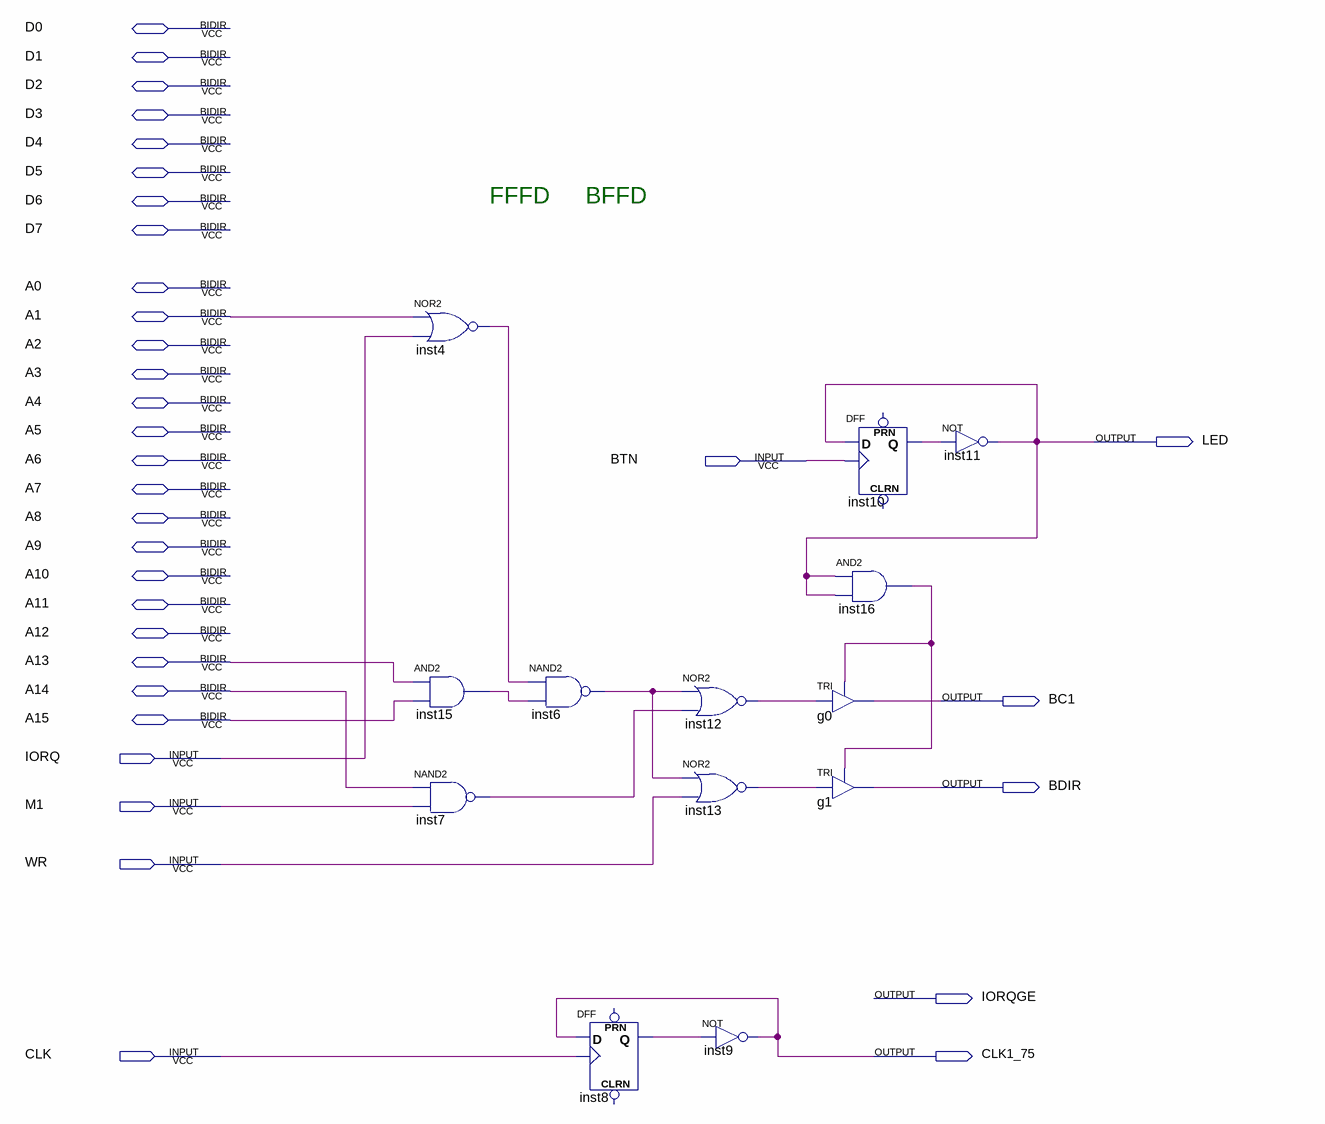
[diagram p0: schematic sheet]
// Quartus schematic ay_first_test.bdf as structural Verilog: 13 symbols, 34 pins
module ay_first_test (
  input  BTN,
  input  IORQ,
  input  M1,
  input  WR,
  input  CLK,
  inout  D0,
  inout  D1,
  inout  D2,
  inout  D3,
  inout  D4,
  inout  D5,
  inout  D6,
  inout  D7,
  inout  A0,
  inout  A1,
  inout  A2,
  inout  A3,
  inout  A4,
  inout  A5,
  inout  A6,
  inout  A7,
  inout  A8,
  inout  A9,
  inout  A10,
  inout  A11,
  inout  A12,
  inout  A13,
  inout  A14,
  inout  A15,
  output LED,
  output BC1,
  output BDIR,
  output IORQGE,
  output CLK1_75
);

  wire inst4_out, inst6_out, inst7_out, inst8_q, inst10_q, inst12_out, inst13_out, inst15_out, inst16_out;

  nor inst4 (inst4_out, A1, IORQ);
  and inst15 (inst15_out, A13, A15);
  nand inst7 (inst7_out, A14, M1);
  nand inst6 (inst6_out, inst4_out, inst15_out);
  DFF inst8 (.CLK(CLK), .D(CLK1_75), .Q(inst8_q));  // open: CLRN, PRN
  nor inst12 (inst12_out, inst6_out, inst7_out);
  nor inst13 (inst13_out, inst6_out, WR);
  not inst9 (CLK1_75, inst8_q);
  and inst16 (inst16_out, LED, LED);
  TRI g0 (.IN(inst12_out), .OE(inst16_out), .OUT(BC1));
  TRI g1 (.IN(inst13_out), .OE(inst16_out), .OUT(BDIR));
  DFF inst10 (.CLK(BTN), .D(LED), .Q(inst10_q));  // open: CLRN, PRN
  not inst11 (LED, inst10_q);

  // Notes on the sheet:
  //   FFFD
  //   BFFD
endmodule
